# Altium schematic sheet CM4-GPIO.SchDoc: CM4_GPIO
size A4; SheetNumber: 1; SheetTotal: 3
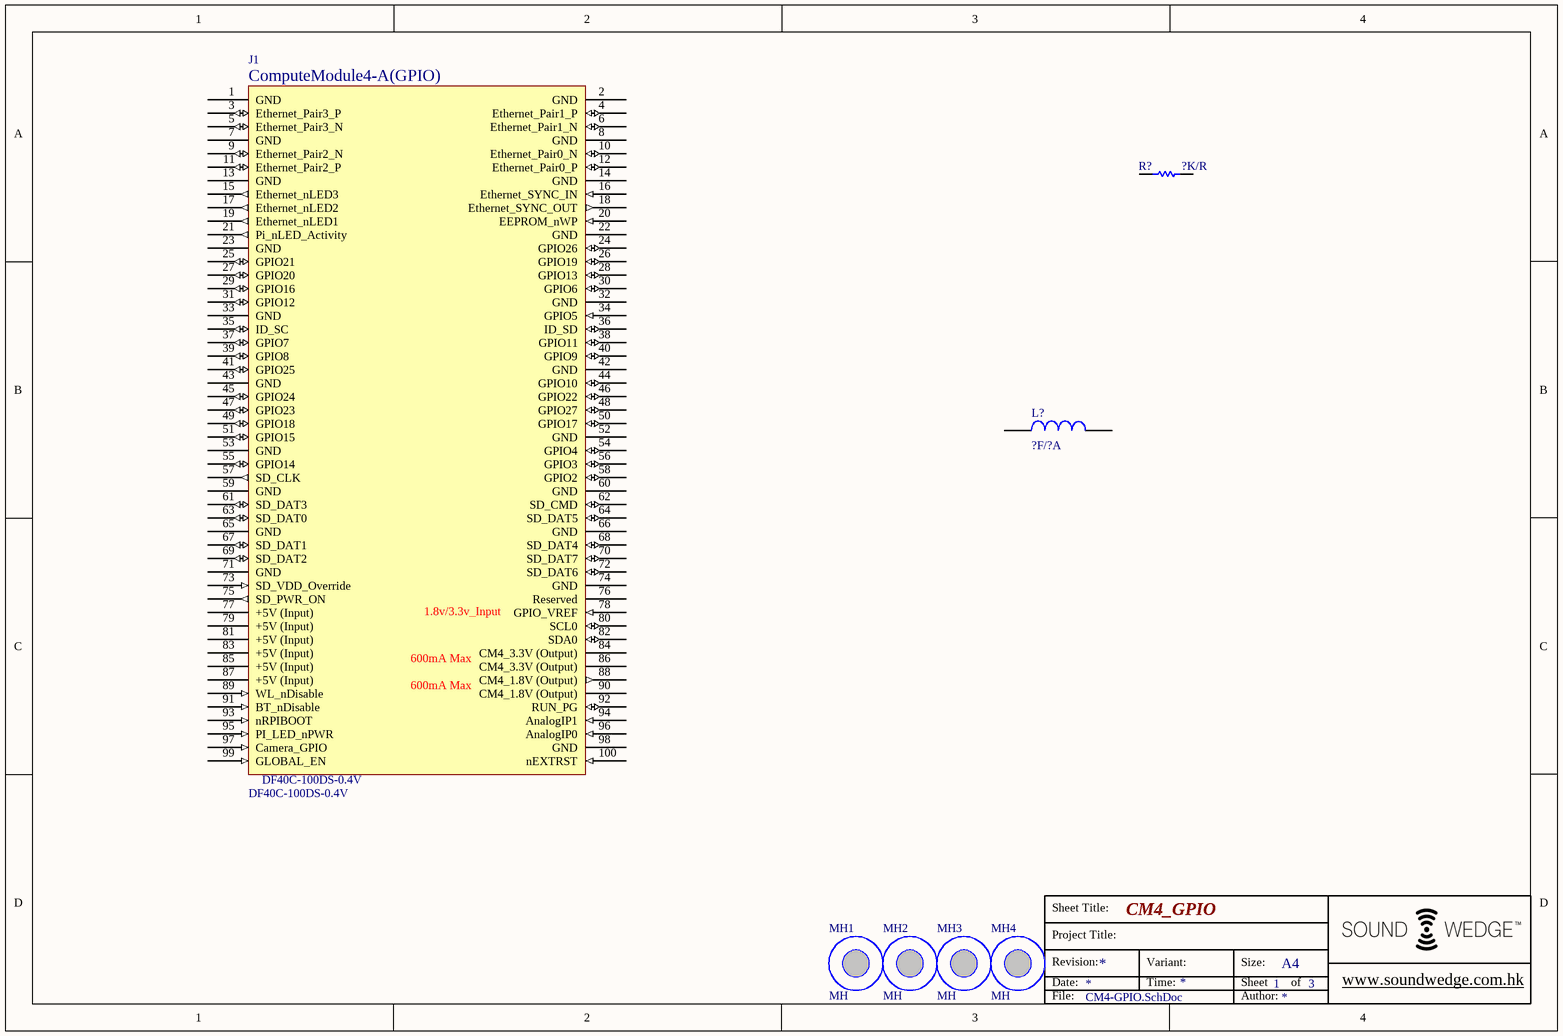
[diagram p0: CM4-GPIO.SchDoc]

## Parts
J1  DF40C-100DS-0.4V  [DF40C100DS04V51(CM4-A)]
L?  ?F/?A  [AL0204]
MH1  MH  [M2.5]
MH2  MH  [M2.5]
MH3  MH  [M2.5]
MH4  MH  [M2.5]
R?  ?K/R  [0201R]

## Nets

Not connected (* = marked no-connect by the designer): J1 1(GND) 2(GND) 3(Ethernet_Pair3_P) 4(Ethernet_Pair1_P) 5(Ethernet_Pair3_N) 6(Ethernet_Pair1_N) 7(GND) 8(GND) 9(Ethernet_Pair2_N) 10(Ethernet_Pair0_N) 11(Ethernet_Pair2_P) 12(Ethernet_Pair0_P) 13(GND) 14(GND) 15(Ethernet_nLED3) 16(Ethernet_SYNC_IN) 17(Ethernet_nLED2) 18(Ethernet_SYNC_OUT) 19(Ethernet_nLED1) 20(EEPROM_nWP) 21(Pi_nLED_Activity) 22(GND) 23(GND) 24(GPIO26) 25(GPIO21) 26(GPIO19) 27(GPIO20) 28(GPIO13) 29(GPIO16) 30(GPIO6) 31(GPIO12) 32(GND) 33(GND) 34(GPIO5) 35(ID_SC) 36(ID_SD) 37(GPIO7) 38(GPIO11) 39(GPIO8) 40(GPIO9) 41(GPIO25) 42(GND) 43(GND) 44(GPIO10) 45(GPIO24) 46(GPIO22) 47(GPIO23) 48(GPIO27) 49(GPIO18) 50(GPIO17) 51(GPIO15) 52(GND) 53(GND) 54(GPIO4) 55(GPIO14) 56(GPIO3) 57(SD_CLK) 58(GPIO2) 59(GND) 60(GND) 61(SD_DAT3) 62(SD_CMD) 63(SD_DAT0) 64(SD_DAT5) 65(GND) 66(GND) 67(SD_DAT1) 68(SD_DAT4) 69(SD_DAT2) 70(SD_DAT7) 71(GND) 72(SD_DAT6) 73(SD_VDD_Override) 74(GND) 75(SD_PWR_ON) 76(Reserved) 77(+5V_(Input)) 78(GPIO_VREF) 79(+5V_(Input)) 80(SCL0) 81(+5V_(Input)) 82(SDA0) 83(+5V_(Input)) 84(CM4_3.3V_(Output)) 85(+5V_(Input)) 86(CM4_3.3V_(Output)) 87(+5V_(Input)) 88(CM4_1.8V_(Output)) 89(WL_nDisable) 90(CM4_1.8V_(Output)) 91(BT_nDisable) 92(RUN_PG) 93(nRPIBOOT) 94(AnalogIP1) 95(PI_LED_nPWR) 96(AnalogIP0) 97(Camera_GPIO) 98(GND) 99(GLOBAL_EN) 100(nEXTRST); L? 1 2; R? 1 2

## Notes on the sheet
- Sheet Title:
- Project Title:
- Date:
- Revision:
- Time:
- Variant:
- Size:
- Sheet
- A4
- of
- www.soundwedge.com.hk <http://www.soundwedge.com.hk>
- File:
- Author:
- (in symbol RPi-CM4-A) ComputeModule4-A(GPIO); 1.8v/3.3v_Input; 600mA Max

## Library data of the parts
J1 = RPi-CM4-A: CM4-A GPIO
L? = INDCTOR: 电感
MH1-MH4 = MH: 安装孔-附加安装铜柱信息
R? = RES